# Altium schematic sheet channel12.SchDoc
size A4
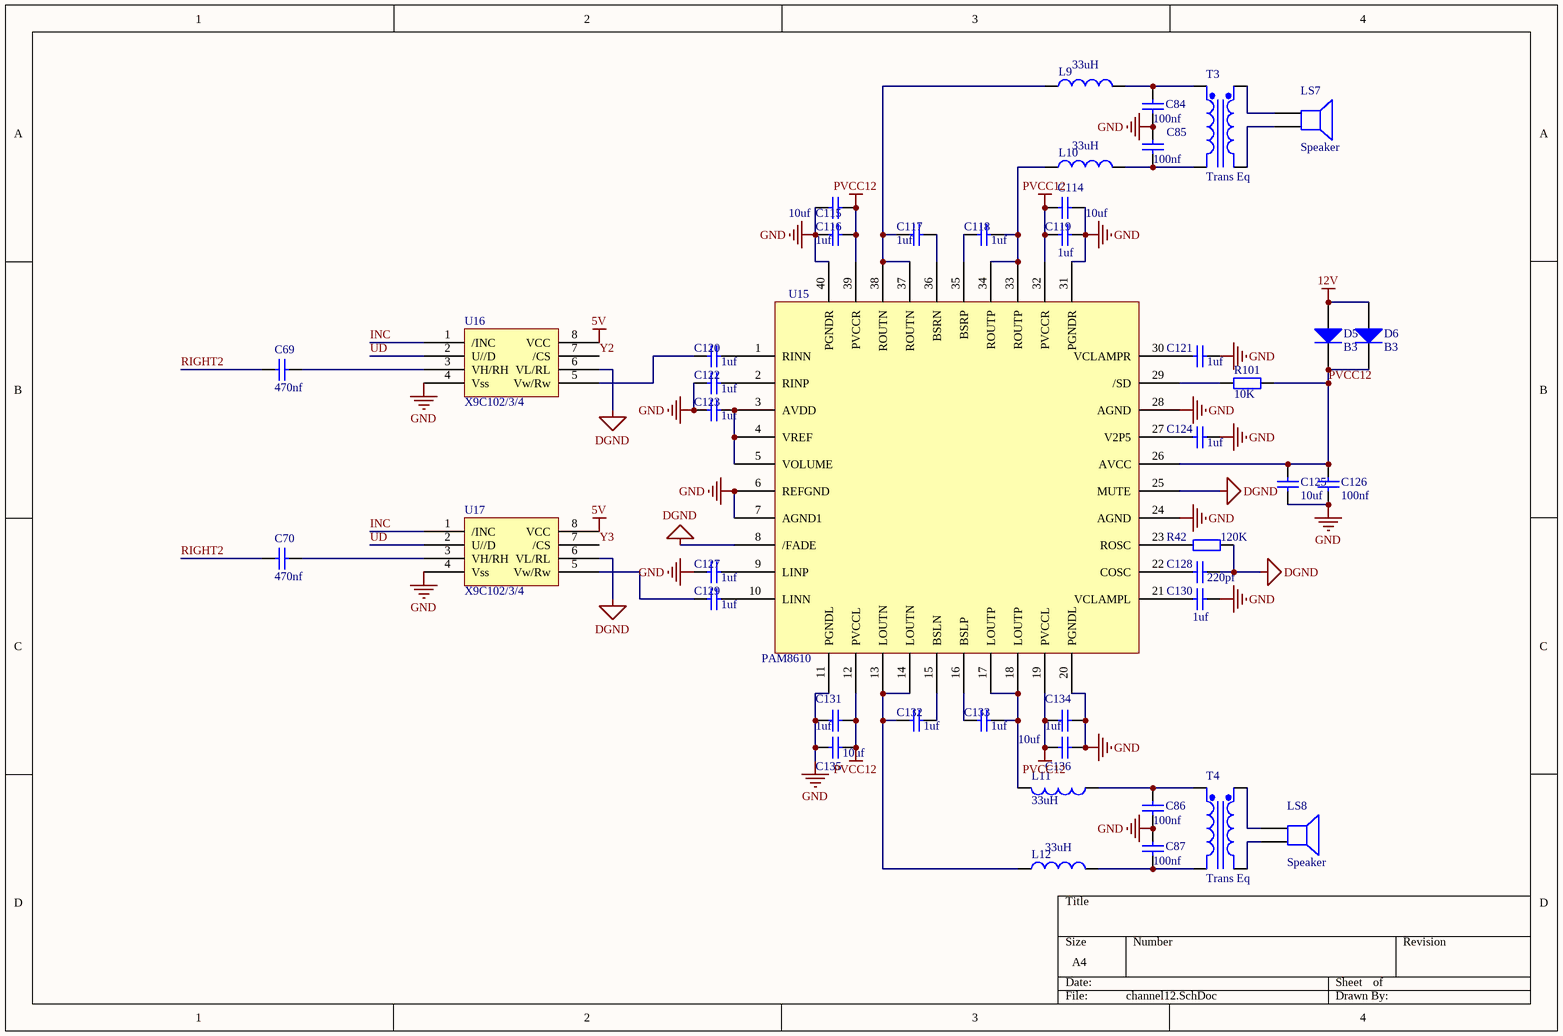
[diagram p0: channel12.SchDoc]

## Parts
C69  470nf  [0805C]
C70  470nf  [0805C]
C84  100nf  [0805C]
C85  100nf  [0805C]
C86  100nf  [0805C]
C87  100nf  [0805C]
C114  10uf  [0805C]
C115  10uf  [0805C]
C116  1uf  [0805C]
C117  1uf  [0805C]
C118  1uf  [0805C]
C119  1uf  [0805C]
C120  1uf  [0805C]
C121  1uf  [0805C]
C122  1uf  [0805C]
C123  1uf  [0805C]
C124  1uf  [0805C]
C125  10uf  [0805C]
C126  100nf  [0805C]
C127  1uf  [0805C]
C128  220pf  [0805C]
C129  1uf  [0805C]
C130  1uf  [0805C]
C131  1uf  [0805C]
C132  1uf  [0805C]
C133  1uf  [0805C]
C134  1uf  [0805C]
C135  10uf  [0805C]
C136  10uf  [0805C]
D5  B3  [LL-34 - duplicate]
D6  B3  [LL-34 - duplicate]
L9  33uH  [L0805]
L10  33uH  [L0805]
L11  33uH  [L0805]
L12  33uH  [L0805]
LS7  Speaker  [耳机座]
LS8  Speaker  [耳机座]
R42  120K  [0805R]
R101  10K  [0805R]
T3  Trans Eq  [Transistor]
T4  Trans Eq  [Transistor]
U15  PAM8610  [QFN40-0.5]
U16  X9C102/3/4  [sop_8]
U17  X9C102/3/4  [sop_8]

## Nets
5V: U16.8(VCC) U17.8(VCC)
12V: D5.1(A) D6.1(A)
DGND: C128.1 R42.2 U15.8(/FADE) U15.25(MUTE) U16.6(VL/RL) U17.6(VL/RL)
GND: C84.2 C85.1 C86.2 C87.1 C114.2 C115.1 C116.1 C119.2 C121.1 C122.2 C123.2 C124.1 C125.2 C126.2 C127.2 C130.2 C131.2 C134.1 C135.2 C136.1 U15.6(REFGND) U15.7(AGND1) U15.11(PGNDL) U15.20(PGNDL) U15.24(AGND) U15.28(AGND) U15.31(PGNDR) U15.40(PGNDR) U16.4(Vss) U17.4(Vss)
PVCC12: C114.1 C115.2 C116.2 C119.1 C125.1 C126.1 C131.1 C134.2 C135.1 C136.2 D5.2(K) D6.2(K) R101.1 U15.12(PVCCL) U15.19(PVCCL) U15.26(AVCC) U15.32(PVCCR) U15.39(PVCCR)
INC: U16.1(/INC) U17.1(/INC)
RIGHT2: C69.2 C70.2
UD: U16.2(U//D) U17.2(U//D)
Y2: U16.7(/CS)
Y3: U17.7(/CS)
NetC69_1: C69.1 U16.3(VH/RH)
NetC70_1: C70.1 U17.3(VH/RH)
NetC84_1: C84.1 L9.2 T3.1(Pri+)
NetC85_2: C85.2 L10.2 T3.2(Pri-)
NetC86_1: C86.1 L11.1 T4.1(Pri+)
NetC87_2: C87.2 L12.2 T4.2(Pri-)
NetC117_1: C117.1 U15.36(BSRN)
NetC117_2: C117.2 L9.1 U15.37(ROUTN) U15.38(ROUTN)
NetC118_1: C118.1 L10.1 U15.33(ROUTP) U15.34(ROUTP)
NetC118_2: C118.2 U15.35(BSRP)
NetC120_1: C120.1 U15.1(RINN)
NetC120_2: C120.2 U16.5(Vw/Rw)
NetC121_2: C121.2 U15.30(VCLAMPR)
NetC122_1: C122.1 U15.2(RINP)
NetC123_1: C123.1 U15.3(AVDD) U15.4(VREF) U15.5(VOLUME)
NetC124_2: C124.2 U15.27(V2P5)
NetC127_1: C127.1 U15.9(LINP)
NetC128_2: C128.2 U15.22(COSC)
NetC129_1: C129.1 U15.10(LINN)
NetC129_2: C129.2 U17.5(Vw/Rw)
NetC130_1: C130.1 U15.21(VCLAMPL)
NetC132_1: C132.1 U15.15(BSLN)
NetC132_2: C132.2 L12.1 U15.13(LOUTN) U15.14(LOUTN)
NetC133_1: C133.1 L11.2 U15.17(LOUTP) U15.18(LOUTP)
NetC133_2: C133.2 U15.16(BSLP)
NetLS7_1: LS7.1 T3.3(Sec+)
NetLS7_2: LS7.2 T3.4(Sec-)
NetLS8_1: LS8.1 T4.3(Sec+)
NetLS8_2: LS8.2 T4.4(Sec-)
NetR42_1: R42.1 U15.23(ROSC)
NetR101_2: R101.2 U15.29(/SD)

## Library data of the parts
C69 C70 C84-C87 C114-C136 = Cap: Capacitor; Value: 0.1uF; Published: 8-Jun-2000; LatestRevisionDate: 17-Jul-2002; LatestRevisionNote: Re-released for DXP Platform.; PackageReference: RAD-0.3; Publisher: Altium Limited; PackageDescription: Radial Cap, Thru-Hole; 2 Leads; 0.3 in Pin Spacing
D5 D6 = Diode 1N4148: High Conductance Fast Diode; Published: 8-Jun-2000; LatestRevisionDate: 17-Jul-2002; LatestRevisionNote: Re-released for DXP Platform.; DatasheetVersion: 1997; PackageReference: DO-35; Publisher: Altium Limited; PackageDescription: Diode, Axial; Body 3.8 x 1.9 mm (LxDia. max), Lead Dia. 0.53 mm (max); Code_JEDEC: DO-204-AH; ComponentLink1Description: Manufacturer Link; ComponentLink1URL: http://www.fairchildsemi.com/; ComponentLink2Description: Datasheet; ComponentLink2URL: http://www.fairchildsemi.com/ds/1N%2F1N4148.pdf
L9-L12 = Inductor: Code_IEC: 1005; Published: 8-Jun-2000; LatestRevisionDate: 29-May-2009; LatestRevisionNote: IPC-7351 Footprint Added.; PackageReference: 0402-A; Publisher: Altium Limited; PackageDescription: Chip Inductor; Code_JEITA: 0402
LS7 LS8 = Speaker: Loudspeaker; Published: 24-Mar-1999; LatestRevisionDate: 17-Jul-2002; LatestRevisionNote: Re-released for DXP Platform.; PackageReference: PIN2; Publisher: Altium Limited
R42 = Res2: Resistor; Value: 10K; Published: 8-Jun-2000; LatestRevisionDate: 17-Jul-2002; LatestRevisionNote: Re-released for DXP Platform.; PackageReference: AXIAL-0.4; Publisher: Altium Limited; PackageDescription: Axial Device, Thru-Hole; 2 Leads; 0.4 in Pin Spacing
R101 = Res2: Resistor; Published: 8-Jun-2000; LatestRevisionDate: 17-Jul-2002; LatestRevisionNote: Re-released for DXP Platform.; PackageReference: AXIAL-0.4; Publisher: Altium Limited; PackageDescription: Axial Device, Thru-Hole; 2 Leads; 0.4 in Pin Spacing; Value: 10K
T3 T4 = Trans Eq: Transformer (Equivalent Circuit Model); Published: 8-Jun-2000; LatestRevisionDate: 17-Jul-2002; LatestRevisionNote: Re-released for DXP Platform.; PackageReference: TRF_4; Publisher: Altium Limited; PackageDescription: Transformer; 4 Leads